# EAGLE design ScreenCircuitV0.2 (EAGLE 8.4.1)
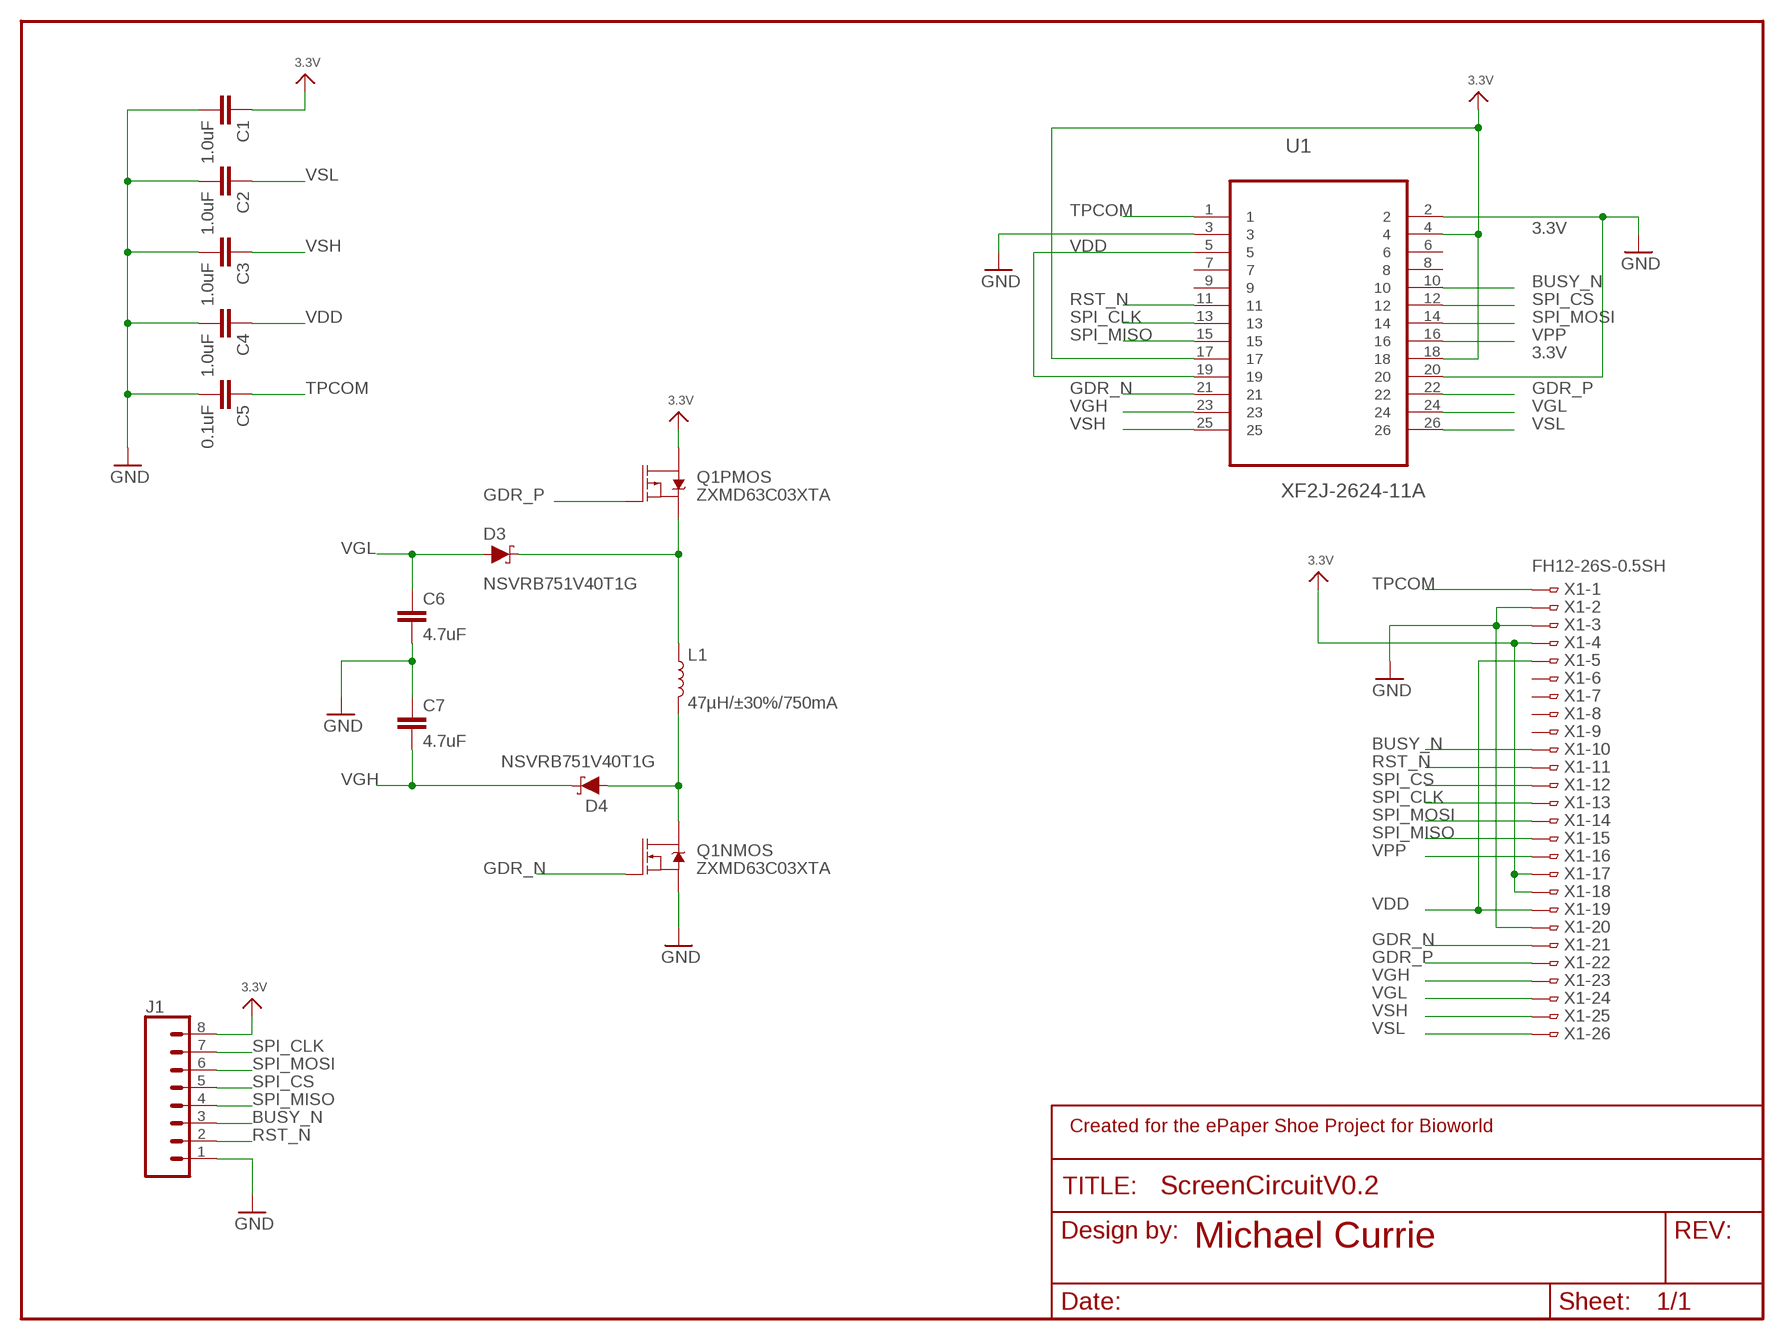
[diagram p0: schematic, sheet 1]

## Parts
C1  1.0uF  1.0UF-1206-50V-10%  [1206]
C2  1.0uF  1.0UF-1206-50V-10%  [1206]
C3  1.0uF  1.0UF-1206-50V-10%  [1206]
C4  1.0uF  1.0UF-1206-50V-10%  [1206]
C5  0.1uF  0.1UF-0603-100V-10%  [0603]
C6  4.7uF  4.7UF-1206-16V-(+80/-20%)  [1206]
C7  4.7uF  4.7UF-1206-16V-(+80/-20%)  [1206]
D3  0.5A/40V/420mV  DIODE-SCHOTTKY-PMEG4005EJ  [SOD-323]
D4  0.5A/40V/420mV  DIODE-SCHOTTKY-PMEG4005EJ  [SOD-323]
FRAME1  FRAME-LETTER-MICHAELNO_PACKAGE  [DUMMY]
J1  CONN_08"  [1X08]
L1  47µH/±30%/750mA  INDUCTOR-CR54-47UH  [CR54]
Q1  IRF7509  [MSOP8]
U1  XF2J-2624-11A  [OMRON_XF2J-2624-11A]
X1  FH12-26S-0.5SH  [FH12-26S-0.5SH]

## Nets
3.3V: C1.1 J1.8 Q1.5(PMOS:D) Q1.6(PMOS:D) U1.4 U1.17 U1.18 X1.4 X1.17 X1.18
BUSY_N: J1.3 U1.10 X1.10
GDR_N: Q1.2(NMOS:G) U1.21 X1.21
GDR_P: Q1.4(PMOS:G) U1.22 X1.22
GND: C1.2 C2.2 C3.2 C4.2 C5.2 C6.2 C7.1 J1.1 Q1.1(NMOS:S) U1.2 U1.3 U1.20 X1.2 X1.3 X1.20
N$3: D3.C L1.P$1 Q1.3(PMOS:S)
N$5: D4.A L1.P$2 Q1.7(NMOS:D) Q1.8(NMOS:D)
RST_N: J1.2 U1.11 X1.11
SPI_CLK: J1.7 U1.13 X1.13
SPI_CS: J1.5 U1.12 X1.12
SPI_MISO: J1.4 U1.15 X1.15
SPI_MOSI: J1.6 U1.14 X1.14
TPCOM: C5.1 U1.1 X1.1
VDD: C4.1 U1.5 U1.19 X1.5 X1.19
VGH: C7.2 D4.C U1.23 X1.23
VGL: C6.1 D3.A U1.24 X1.24
VPP: U1.16 X1.16
VSH: C3.1 U1.25 X1.25
VSL: C2.1 U1.26 X1.26
Unconnected: U1.6 U1.7 U1.8 U1.9 X1.6 X1.7 X1.8 X1.9

## Notes on the sheet
- ZXMD63C03XTA
- NSVRB751V40T1G
- NSVRB751V40T1G
- ZXMD63C03XTA

## Library data of the parts
C1-C4 = SparkFun-Capacitors:1.0UF: 1µF ceramic capacitors A capacitor is a passive two-terminal electrical component used to store electrical energy temporarily in an electric field.; PROD_ID: CAP-09822
C5 = SparkFun-Capacitors:0.1UF: 0.1µF ceramic capacitors A capacitor is a passive two-terminal electrical component used to store electrical energy temporarily in an electric field.; PROD_ID: CAP-08390
C6 C7 = SparkFun-Capacitors:4.7UF: 4.7µF ceramic capacitors A capacitor is a passive two-terminal electrical component used to store electrical energy temporarily in an electric field.; PROD_ID: CAP-10300
D3 D4 = SparkFun-DiscreteSemi:DIODE-SCHOTTKY: Schottky diode A Schottky diode is a semiconductor diode which has a low forward voltage drop and a very fast switching action.; PROD_ID: DIO-10955
FRAME1 = SparkFun-Aesthetics:FRAME-LETTER-MICHAEL: Schematic Frame - Letter Standard 8.5x11 US Letter frame; DESIGNER: Nobody; VERSION: v01
J1 = SparkFun-Connectors:CONN_08: Multi connection point. Often used as Generic Header-pin footprint for 0.1 inch spaced/style header connections On any of the 0.1 inch spaced packages, you can populate with these: Break Away Headers - Straight <https://www.sparkfun.com/products/116> (PRT-00116) Break Away Male Headers - Right Angle <https://www.sparkfun.com/products/553> (PRT-00553) Female Headers <https://www.sparkfun.com/products/115> (PRT-00115) Break Away Headers - Machine Pin <https://www.sparkfun.com/products/117> (PRT-00117) Break Away Female Headers - Swiss Machine Pin <https://www.sparkfun.com/products/743> (PRT-00743) Arduino Stackable Header - 8 Pin <https://www.sparkfun.com/products/9279> (PRT-09279) For SCREWTERMINALS and SPRING TERMINALS visit here: Screw Terimnals on SparkFun.com <https://www.sparkfun.com/search/results?term=Screw+Terminals> (5mm/3.5mm/2.54mm spacing) This device is also useful as a general connection point to wire up your design to another part of your project. Our various solder wires solder well into these plated through hole pads. Hook-Up Wire - Assortment (Stranded, 22 AWG) <https://www.sparkfun.com/products/11375> (PRT-11375) Hook-Up Wire - Assortment (Solid Core, 22 AWG) <https://www.sparkfun.com/products/11367> (PRT-11367) View the entire wire category on our website here <https://www.sparkfun.com/categories/141> Special notes: Molex polarized connector foot print use with SKU : PRT-08231 with associated crimp pins and housings. 1MM SMD Version SKU: PRT-10208 NOTES ON THE VARIANTS LOCK and LOCK_LONGPADS... This footprint was designed to help hold the alignment of a through-hole component (i.e. 6-pin header) while soldering it into place. You may notice that each hole has been shifted either up or down by 0.005 of an inch from it's more standard position (which is a perfectly straight line). This slight alteration caused the pins (the squares in the middle) to touch the edges of the holes. Because they are alternating, it causes a "brace" to hold the component in place. 0.005 has proven to be the perfect amount of "off-center" position when using our standard breakaway headers. Although looks a little odd when you look at the bare footprint, once you have a header in there, the alteration is very hard to notice. Also,if you push a header all the way into place, it is covered up entirely on the bottom side.; PROD_ID: CONN-08438
L1 = SparkFun-Coils:INDUCTOR: Inductors Resist changes in electrical current. Basically a coil of wire. SparkFun Products: SparkFun Load Cell Amplifier - HX711 <https://www.sparkfun.com/products/13879> IOIO-OTG - V2.2 <https://www.sparkfun.com/products/13613>; PROD_ID: NDUC-10789
Q1 = SparkFun-DiscreteSemi:IRF7509: Dual N and P Channel MOSFET Dual N/P-Channel 30V 1.25 W 7.8/7.5 nC Hexfet Power Mosfet Surface Mount-MICRO-8. NMOS RDS(ON) 0.11Ω. PMOS RDS(ON) 0.20Ω. Link to datasheet <http://www.irf.com/product-info/datasheets/data/irf7509pbf.pdf> SparkFun Products: SparkFun RedBot Mainboard <https://www.sparkfun.com/products/12097> SparkFun Wake on Shake <https://www.sparkfun.com/products/11447>; PROD_ID: TRANS-07913
U1 = OMRON ELECTRONIC COMPONENTS_By_element14_Batch_1:XF2J-2624-11A: FFC/FPC CONNECTOR, RECEPTACLE 26POS 1ROW; MPN: XF2J-2624-11A; OC_FARNELL: -; OC_NEWARK: 05M1981; PACKAGE: FFC/FPC CONNECTOR, RECEPTACLE 26POS 1ROW; SUPPLIER: OMRON ELECTRONIC COMPONENTS
X1 = con-hirose:FH12-26S-0.5S: 0.5mm Pitch Connectors For FPC/FFC Source: Data sheet <http://www.hirose.co.jp/cataloge_hp/e58605370.pdf>; MPN: FH12-26S-0.5SH(55); OC_FARNELL: 1324553; OC_NEWARK: 34M6172

## Board
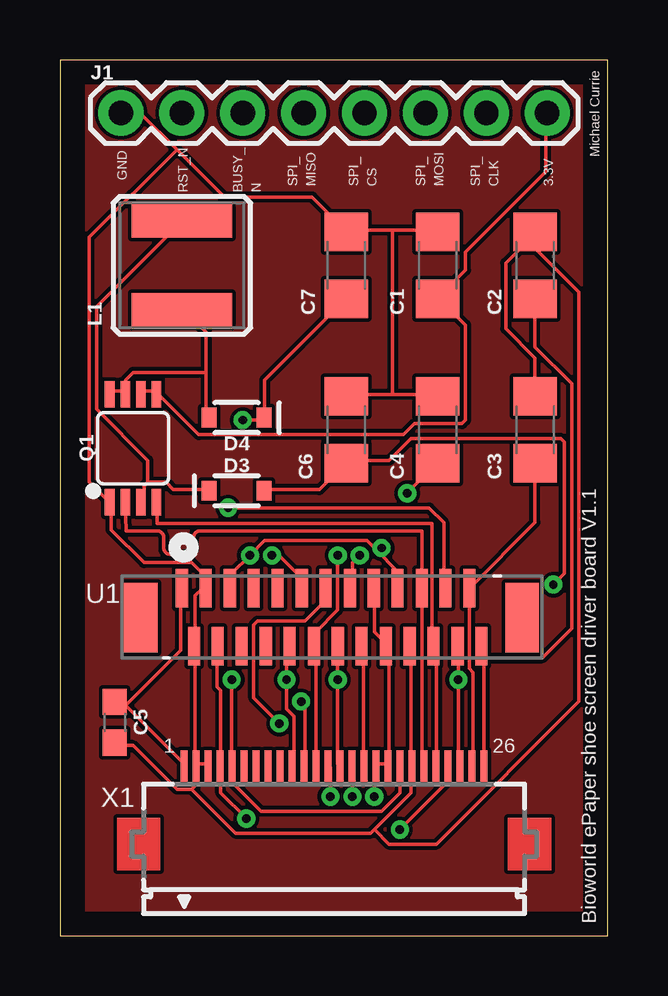
[diagram p1: board, top side]
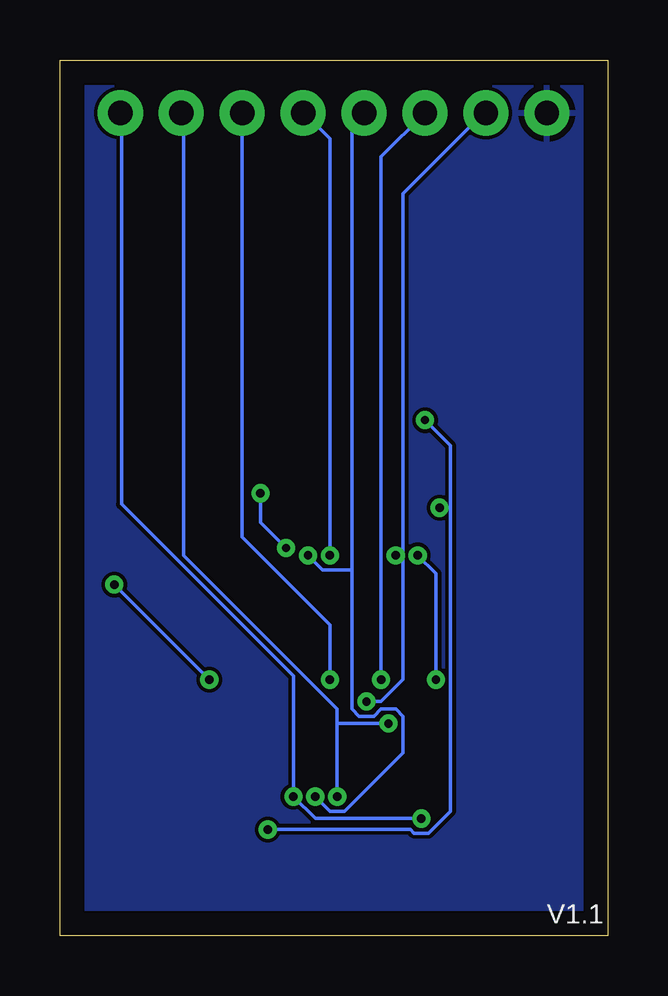
[diagram p2: board, bottom side, seen from below]

Size 22.84 x 36.5 mm. Coordinates in mm from the lower left corner, seen from the top.
Outline: 0,0 22.84,0 22.84,36.5 0,36.5 0,0
Copper layers (1*16): Top 0.035mm / dielectric 1.5mm / Bottom 0.035mm
Design rules "default": minimum track width 6mil, minimum drill 0.35mm, track to track 6mil, track to pad 6mil, pad to pad 6mil, via to via 6mil, smd to smd 6mil, copper to edge 40mil, drill to drill 6mil, minimum pad ring 10mil, minimum via ring 8mil, stop-mask expansion 4mil, vias tented up to drill 0mil, thermal gap 10mil

### Footprints (pad centres in the part's own frame; a part is rotated, then mirrored left to right if it is on the bottom)
1206 = smd 1.6 x 1.8: 1 -1.4,0; 2 1.4,0
0603 = smd 1.1 x 1: 1 -0.85,0; 2 0.85,0
SOD-323 = smd 0.63 x 0.83: A 1.15,0; C -1.15,0
1X08 = drill 1.016 pad 1.88: 1 0,0; 2 2.54,0; 3 5.08,0; 4 7.62,0; 5 10.16,0; 6 12.7,0; 7 15.24,0; 8 17.78,0
CR54 = smd 4.2 x 1.4: P$1 0,1.85; P$2 0,-1.85
MSOP8 = smd 0.4 x 1.1: 1 -0.975,-2.25; 2 -0.325,-2.25; 3 0.325,-2.25; 4 0.975,-2.25; 5 0.975,2.25; 6 0.325,2.25; 7 -0.325,2.25; 8 -0.975,2.25
OMRON_XF2J-2624-11A = smd 0.508 x 1.6: 1 0,4.826; 2 0.508,2.413; 3 0.991,4.826; 4 1.499,2.413; 5 2.007,4.826; 6 2.489,2.413; 7 2.997,4.826; 8 3.505,2.413; 9 3.988,4.826; 10 4.496,2.413; 11 5.004,4.826; 12 5.512,2.413; 13 5.994,4.826; 14 6.502,2.413; 15 7.01,4.826; 16 7.493,2.413; 17 8.001,4.826; 18 8.509,2.413; 19 8.992,4.826; 20 9.5,2.413; 21 10.008,4.826; 22 10.49,2.413; 23 10.998,4.826; 24 11.506,2.413; 25 11.989,4.826; 26 12.497,2.413 | smd 1.397 x 2.896: 27 -1.702,3.607; 28 14.199,3.607
FH12-26S-0.5SH = smd 0.3 x 1.3: 1 -6.25,3.25; 2 -5.75,3.25; 3 -5.25,3.25; 4 -4.75,3.25; 5 -4.25,3.25; 6 -3.75,3.25; 7 -3.25,3.25; 8 -2.75,3.25; 9 -2.25,3.25; 10 -1.75,3.25; 11 -1.25,3.25; 12 -0.75,3.25; 13 -0.25,3.25; 14 0.25,3.25; 15 0.75,3.25; 16 1.25,3.25; 17 1.75,3.25; 18 2.25,3.25; 19 2.75,3.25; 20 3.25,3.25; 21 3.75,3.25; 22 4.25,3.25; 23 4.75,3.25; 24 5.25,3.25; 25 5.75,3.25; 26 6.25,3.25

### Placement (x,y rotation side)
C1  15.75,27.94 90 top
C2  19.81,27.94 90 top
C3  19.81,21.08 90 top
C4  15.75,21.08 90 top
C5  2.29,8.89 270 top
C6  11.94,21.08 90 top
C7  11.94,27.94 270 top
D3  7.37,18.54 0 top
D4  7.37,21.59 180 top
FRAME1  22.86,36.83 0 top
J1  2.54,34.29 0 top
L1  5.08,27.94 0 top
Q1  3.05,20.32 0 top
U1  5.08,9.65 0 top
X1  11.43,3.81 0 top

### Tracks (layer width: path | path; a pad name or v marks a point on that pad's centre or on a via)
3.3V  (via drill 0.35)
  Top 0.152: U1.4 6.55,12.04 6.55,10.36 6.71,10.21 6.71,7.16 X1.4 6.71,7.01 6.71,5.94 v7.77,4.88 | U1.17 13.11,14.48 13.11,12.65 13.56,12.19 U1.18 13.72,12.04 13.72,7.16 X1.18 13.56,7.16 13.26,7.16 X1.17 13.11,7.01 v13.11,5.79 | Q1.6 3.5,22.71 3.96,22.71 Q1.5 4.12,22.55 5.79,20.88 14.33,20.88 14.78,21.34 16.76,21.34 16.92,21.49 16.92,25.45 15.85,26.52 C1.1 15.85,26.67 16.92,27.74 16.92,28.5 20.27,31.85 20.27,34.29 J1.8
  Bottom 0.152: v7.77,4.88 12.19,4.88 v13.11,5.79 13.11,10.82 20.27,17.98 20.27,34.29 J1.8
BUSY_N  (via drill 0.35)
  Top 0.152: X1.10 9.75,7.16 9.75,9.14 9.45,9.45 v9.45,10.67 9.45,12.04 U1.10
  Bottom 0.152: v9.45,10.67 9.45,32.46 J1.3
GDR_N
  Top 0.152: Q1.2 2.76,16.87 4.06,16.87 arc-90 4.33,16.6 4.33,16.16 arc90 4.59,15.9 5.31,15.9 arc90 5.58,16.16 5.58,16.6 arc-90 5.84,16.87 15.09,16.87 15.09,14.94 15.09,14.92 U1.21 15.09,7.16 X1.21
GDR_P
  Top 0.152: Q1.4 4.06,17.17 15.52,17.17 15.52,12.7 15.54,12.65 15.54,12.19 U1.22 15.7,12.04 15.7,7.16 X1.22
GND
  Top 0.152: 13.87,22.55 15.7,22.55 C4.2 | 13.87,22.55 12.04,22.55 C6.2 | 13.87,29.41 15.7,29.41 C1.2 | 13.87,29.41 12.04,29.41 C7.1 11.89,29.41 10.52,30.79 6.86,30.79 4.88,32.77 | 13.87,29.41 13.87,22.55 | J1.1 3.35,34.29 4.88,32.77 | C3.2 19.81,24.08 18.59,25.3 18.59,28.04 19.51,28.96 | 19.51,28.96 19.81,29.26 C2.2 19.51,28.96 | U1.20 14.63,12.04 14.63,7.16 X1.20 14.63,7.01 14.63,5.94 13.11,4.42 | 5.49,6.1 4.88,6.1 3.05,7.92 2.29,7.92 C5.2 | 5.49,6.1 5.64,6.25 5.64,7.01 X1.2 | X1.3 6.1,7.16 5.79,7.16 X1.2 | 5.94,14.48 5.94,15.09 5.49,15.54 3.5,15.54 2.13,16.92 2.13,17.98 Q1.1 1.98,18.14 1.22,18.9 1.22,29.11 4.88,32.77 | 5.94,14.48 5.64,14.17 5.64,12.19 U1.2 5.64,12.04 5.64,7.16 X1.2 | 5.94,14.48 U1.3 | 13.11,4.42 12.95,4.27 7.32,4.27 5.49,6.1 | 19.51,28.96 21.64,26.82 21.64,9.75 15.7,3.81 13.72,3.81 13.11,4.42
  pour Bottom: 0.25,36.07 0.25,0.25 22.61,0.25 22.61,36.07
N$1
  pour Top: 0,36.32 0,0.25 22.86,0.25 22.86,36.32
N$3
  Top 0.152: 3.66,18.9 4.42,18.9 4.72,18.59 6.1,18.59 D3.C | 3.66,18.9 3.5,18.75 3.5,18.14 Q1.3 | 3.66,18.9 3.66,19.81 1.52,21.95 1.52,26.21 5.03,29.72 L1.P$1
N$5
  Top 0.152: Q1.8 2.13,22.71 2.59,22.71 Q1.7 2.74,22.71 2.74,23.16 3.05,23.47 6.1,23.47 | 6.1,23.47 6.1,25.15 5.18,26.06 L1.P$2 | 6.1,23.47 6.1,21.64 D4.A
RST_N  (via drill 0.35)
  Top 0.152: v10.06,9.75 10.21,9.6 10.21,7.16 X1.11 | v8.84,15.85 9.14,15.85 10.06,14.94 10.06,14.48 U1.11
  Bottom 0.152: v10.06,9.75 9.45,9.75 8.53,10.67 8.53,15.85 | 8.53,15.85 8.53,30.94 5.18,34.29 J1.2 | 8.53,15.85 v8.84,15.85
SPI_CLK  (via drill 0.35)
  Top 0.152: v11.28,5.79 11.28,7.01 X1.13 | v9.14,8.84 8.08,9.91 8.08,12.95 8.23,13.11 10.21,13.11 10.97,13.87 10.97,14.48 U1.13
  Bottom 0.152: 11.28,8.84 11.28,9.45 17.68,15.85 17.68,34.29 J1.7 | 11.28,8.84 v11.28,5.79 | 11.28,8.84 v9.14,8.84
SPI_CS  (via drill 0.35)
  Top 0.152: X1.12 10.67,7.16 10.67,12.04 U1.12 10.67,12.19 10.67,12.65 11.58,13.56 v11.58,15.85
  Bottom 0.152: v11.58,15.85 11.58,33.22 12.65,34.29 J1.5
SPI_MISO  (via drill 0.35)
  Top 0.152: v12.19,5.79 12.19,7.01 X1.15 | v12.5,15.85 12.19,15.54 12.19,14.48 U1.15
  Bottom 0.152: v12.19,5.79 11.58,5.18 10.97,5.18 8.53,7.62 8.53,9.14 8.84,9.45 9.45,9.45 9.75,9.14 10.36,9.14 10.67,9.45 10.67,15.24 | 10.67,15.24 10.67,33.83 10.21,34.29 J1.4 | v12.5,15.85 11.89,15.24 10.67,15.24
SPI_MOSI  (via drill 0.35)
  Top 0.152: U1.14 v11.58,10.67 11.58,7.16 X1.14
  Bottom 0.152: v11.58,10.67 11.58,12.95 15.24,16.61 J1.6
TPCOM
  Top 0.152: 2.74,9.6 2.29,9.6 C5.1 2.74,9.6 | 2.74,9.6 5.18,7.16 X1.1 | 2.74,9.6 5.03,11.89 5.03,14.48 U1.1
VDD  (via drill 0.35)
  Top 0.152: X1.19 14.17,7.01 14.17,5.94 13.41,5.18 8.38,5.18 7.16,6.4 7.16,7.01 X1.5 7.16,7.16 v7.16,10.67 | 13.26,16 14.02,15.24 14.02,14.48 U1.19 | 13.26,16 12.8,16.46 8.53,16.46 v7.92,15.85 7.16,15.09 7.16,14.48 U1.5 | v14.48,18.44 15.7,19.66 C4.1 | 13.26,16 v13.41,16.15
  Bottom 0.152: v14.48,18.44 14.48,17.22 v13.41,16.15 | v7.16,10.67 7.16,15.09 v7.92,15.85
VGH  (via drill 0.35)
  Top 0.152: C7.2 11.89,26.52 8.53,23.16 8.53,21.64 D4.C 8.38,21.49 v7.62,21.49 | v14.17,4.42 16.15,6.4 16.15,7.01 X1.23 | v7.01,17.83 15.39,17.83 16,17.22 16,14.48 U1.23
  Bottom 0.152: v14.17,4.42 8.23,4.42 8.08,4.27 7.47,4.27 6.55,5.18 6.55,17.83 | 6.55,17.83 6.55,20.42 v7.62,21.49 | 6.55,17.83 v7.01,17.83
VGL  (via drill 0.35)
  Top 0.152: D3.A 8.53,18.59 10.82,18.59 11.89,19.66 C6.1 12.04,19.81 13.72,19.81 14.63,20.73 20.88,20.73 21.03,20.57 21.03,15.09 v20.57,14.63 | X1.24 16.61,7.16 v16.61,10.67 16.61,12.04 U1.24
  Bottom 0.152: v16.61,10.67 v20.57,14.63
VPP
  Top 0.152: X1.16 12.65,7.16 12.65,12.04 U1.16
VSH
  Top 0.152: X1.25 17.22,7.16 17.22,10.97 17.07,11.12 U1.25 19.81,17.22 C3.1
VSL
  Top 0.152: 17.68,11.58 17.68,12.04 U1.26 17.68,11.58 | 17.68,11.58 17.68,7.16 X1.26 | C2.1 19.81,24.54 21.34,23.01 21.34,12.8 20.12,11.58 17.68,11.58

### Text on the board
tPlace: Michael Currie | GND | RST_N | BUSY_ | N | SPI_ | MISO | SPI_ | CS | SPI_ | MOSI | SPI_ | CLK | 3.3V | 1 | 26 | Bioworld ePaper shoe screen driver board V1.1
bPlace: V1.1